# EAGLE schematic board (EAGLE 9.6.2)
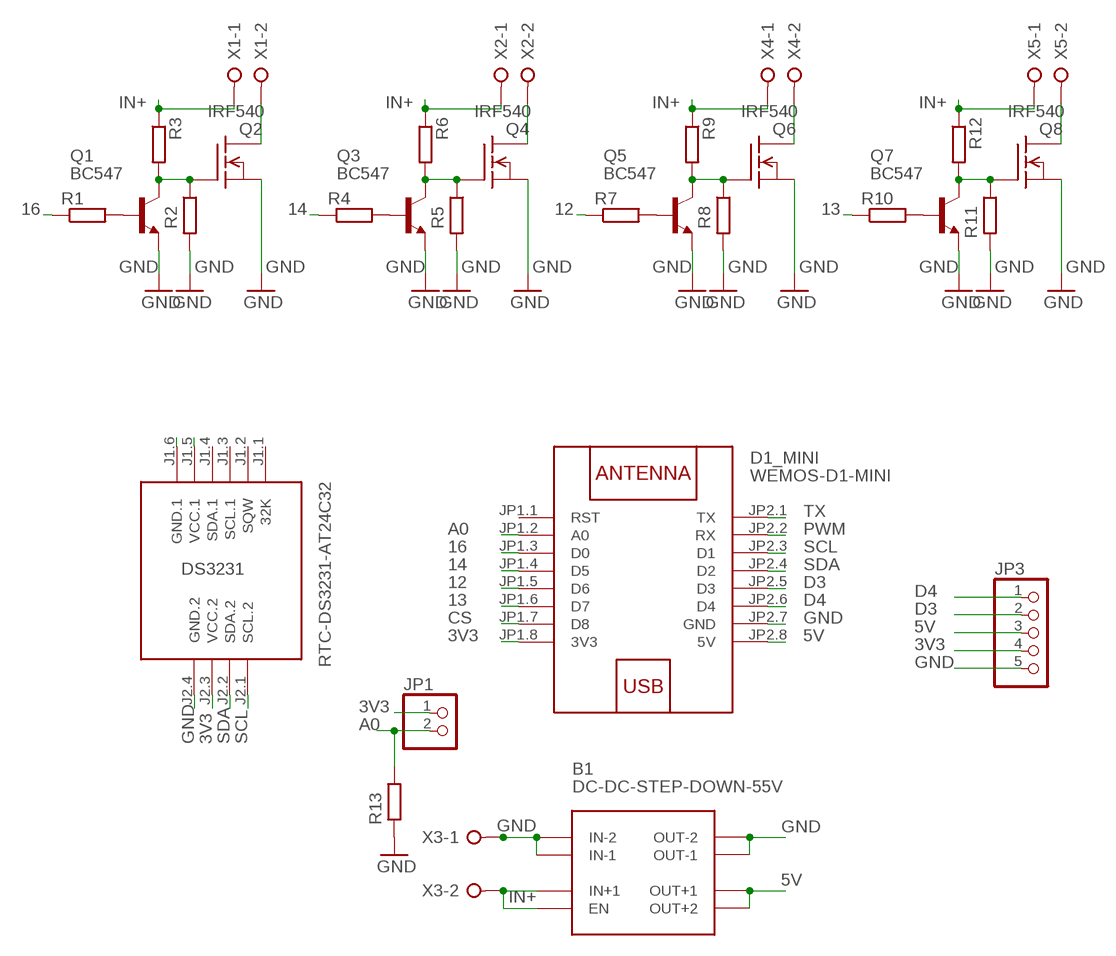
[diagram p0: schematic, sheet 1]

## Parts
B1  DC-DC-STEP-DOWN-55V  [DC-DC-STEP-DOWN-55V]
D1_MINI  WEMOS-D1-MINI  [WEMOS-D1-MINI]
DS3231  RTC-DS3231-AT24C32  [RTC-DS3231-AT24C32]
JP1  PINHD-1X2  [1X02]
JP3  PINHD-1X5  [1X05]
Q1  BC547  [TO92]
Q2  IRF540  [TO220]
Q3  BC547  [TO92]
Q4  IRF540  [TO220]
Q5  BC547  [TO92]
Q6  IRF540  [TO220]
Q7  BC547  [TO92]
Q8  IRF540  [TO220]
R1  R-EU_0207/10  [0207/10]
R2  R-EU_0207/10  [0207/10]
R3  R-EU_0207/10  [0207/10]
R4  R-EU_0207/10  [0207/10]
R5  R-EU_0207/10  [0207/10]
R6  R-EU_0207/10  [0207/10]
R7  R-EU_0207/10  [0207/10]
R8  R-EU_0207/10  [0207/10]
R9  R-EU_0207/10  [0207/10]
R10  R-EU_0207/10  [0207/10]
R11  R-EU_0207/10  [0207/10]
R12  R-EU_0207/10  [0207/10]
R13  R-EU_0207/10  [0207/10]
X1  W237-02P  [W237-132]
X2  W237-02P  [W237-132]
X3  W237-02P  [W237-132]
X4  W237-02P  [W237-132]
X5  W237-02P  [W237-132]

## Nets
3V3: D1_MINI.JP1.8(3V3) DS3231.J2.3(VCC.2) JP1.1 JP3.4
5V: B1.VOUT+1(OUT+1) B1.VOUT+2(OUT+2) D1_MINI.JP2.8(5V) JP3.3
12: D1_MINI.JP1.5(D6) R7.1
13: D1_MINI.JP1.6(D7) R10.1
14: D1_MINI.JP1.4(D5) R4.1
16: D1_MINI.JP1.3(D0) R1.1
A0: D1_MINI.JP1.2(A0) JP1.2 R13.1
CS: D1_MINI.JP1.7(D8)
D3: D1_MINI.JP2.5(D3) JP3.2
D4: D1_MINI.JP2.6(D4) JP3.1
GND: B1.VIN-1(IN-1) B1.VIN-2(IN-2) B1.VOUT-1(OUT-1) B1.VOUT-2(OUT-2) D1_MINI.JP2.7(GND) DS3231.J2.4(GND.2) JP3.5 Q1.1(E) Q2.3(S) Q3.1(E) Q4.3(S) Q5.1(E) Q6.3(S) Q7.1(E) Q8.3(S) R2.2 R5.2 R8.2 R11.2 R13.2 X3.1
IN+: B1.EN B1.VIN+(IN+1) R3.1 R6.1 R9.1 R12.1 X1.1 X2.1 X3.2 X4.1 X5.1
N$1: Q1.2(B) R1.2
N$3: Q1.3(C) Q2.1(G) R2.1 R3.2
N$4: Q3.2(B) R4.2
N$5: Q2.2(D) X1.2
N$7: Q3.3(C) Q4.1(G) R5.1 R6.2
N$8: Q4.2(D) X2.2
N$9: Q5.2(B) R7.2
N$11: Q5.3(C) Q6.1(G) R8.1 R9.2
N$12: Q6.2(D) X4.2
N$13: Q7.2(B) R10.2
N$14: DS3231.J1.6(GND.1)
N$15: DS3231.J1.5(VCC.1)
N$17: Q7.3(C) Q8.1(G) R11.1 R12.2
N$18: Q8.2(D) X5.2
PWM: D1_MINI.JP2.2(RX)
SCL: D1_MINI.JP2.3(D1) DS3231.J2.1(SCL.2)
SDA: D1_MINI.JP2.4(D2) DS3231.J2.2(SDA.2)
TX: D1_MINI.JP2.1(TX)
Unconnected: D1_MINI.JP1.1(RST) DS3231.J1.1(32K) DS3231.J1.2(SQW) DS3231.J1.3(SCL.1) DS3231.J1.4(SDA.1)

## Library data of the parts
B1 = diy-modules:DC-DC-STEP-DOWN-55V
D1_MINI = diy-modules:WEMOS-D1-MINI: WEMOS D1 mini: Mini Wi-Fi Board based on ESP-8266 device More details can be found here: https://www.wemos.cc/product/d1-mini.html Click here to find device on ebay.com <http://www.ebay.com/sch/wemos+d1+mini+nodemcu>
DS3231 = diy-modules:RTC-DS3231-AT24C32: RTC Module with Battery and EEPROM based on DS3231 and AT24C32 chips Tutorial can be found here: https://edwardmallon.wordpress.com/2014/05/21/using-a-cheap-3-ds3231-rtc-at24c32-eeprom-from-ebay/ Click here to find device on ebay.com <http://www.ebay.com/sch/DS3231+AT24C32+module>
JP1 = pinhead:PINHD-1X2: PIN HEADER
JP3 = pinhead:PINHD-1X5: PIN HEADER
Q1 Q3 Q5 Q7 = transistor-npn:BC547*: NPN Transistor
Q2 Q4 Q6 Q8 = transistor-fet:IRF540: N-Channel Enhancement MOSFET (HEXFET); 100V; 28A; 0,077Ohm
R1-R13 = rcl:R-EU_: RESISTOR, European symbol; SPICEPREFIX: R
X1-X5 = con-wago-508:W237-02P: WAGO SREW CLAMP; OC_FARNELL: unknown; OC_NEWARK: unknown

## Net classes
0 default: width 0.406 mm, drill 0.406 mm, clearance 0.406 mm